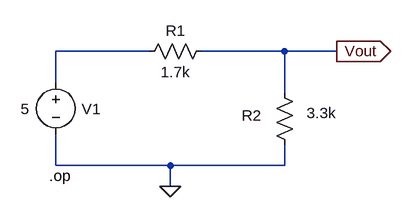
[diagram p0: schematic 02-voltage-divider.asc]
02-voltage-divider.asc, the LTspice schematic file:
Version 4
SHEET 1 880 680
WIRE 128 96 -16 96
WIRE 336 96 208 96
WIRE 416 96 336 96
WIRE -16 144 -16 96
WIRE 336 160 336 96
WIRE -16 272 -16 224
WIRE 160 272 -16 272
WIRE 336 272 336 240
WIRE 336 272 160 272
WIRE 160 304 160 272
FLAG 160 304 0
FLAG 416 96 Vout
IOPIN 416 96 Out
DATAFLAG 0 96 ""
DATAFLAG 352 96 "$"
SYMBOL res 224 80 R90
WINDOW 0 0 56 VBottom 2
WINDOW 3 32 56 VTop 2
SYMATTR InstName R1
SYMATTR Value 1.7k
SYMBOL res 352 256 R180
WINDOW 0 51 61 Left 2
WINDOW 3 -64 65 Left 2
SYMATTR InstName R2
SYMATTR Value 3.3k
SYMBOL voltage -16 128 R0
WINDOW 0 40 57 Left 2
WINDOW 3 -54 57 Left 2
WINDOW 123 0 0 Left 0
WINDOW 39 0 0 Left 0
SYMATTR InstName V1
SYMATTR Value 5
TEXT -26 288 Left 2 !.op

The netlist it stands for:
* 02-voltage-divider.asc
R1 Vout N001 1.7k
R2 0 Vout 3.3k
V1 N001 0 5
.op
.backanno
.end